# EAGLE design Power Distribution 12 v (EAGLE 7.2.0)
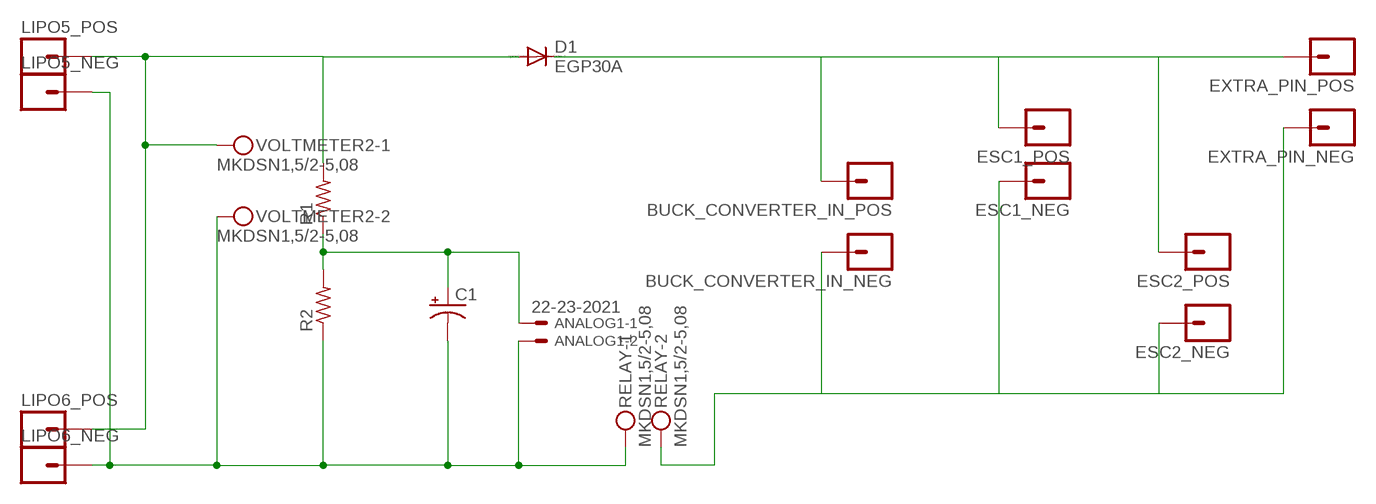
[diagram p0: schematic, sheet 1]

## Parts
ANALOG1  22-23-2021  [22-23-2021]
BUCK_CONVERTER_IN_NEG  M01PTH_2MM  [1X01_2MM]
BUCK_CONVERTER_IN_POS  M01PTH_2MM  [1X01_2MM]
C1  CPOL-USE2-5  [E2-5]
D1  EGP30A  [DO201-15]
ESC1_NEG  M01PTH_2MM  [1X01_2MM]
ESC1_POS  M01PTH_2MM  [1X01_2MM]
ESC2_NEG  M01PTH_2MM  [1X01_2MM]
ESC2_POS  M01PTH_2MM  [1X01_2MM]
EXTRA_PIN_NEG  M01PTH_2MM  [1X01_2MM]
EXTRA_PIN_POS  M01PTH_2MM  [1X01_2MM]
LIPO5_NEG  M01PTH_2MM  [1X01_2MM]
LIPO5_POS  M01PTH_2MM  [1X01_2MM]
LIPO6_NEG  M01PTH_2MM  [1X01_2MM]
LIPO6_POS  M01PTH_2MM  [1X01_2MM]
R1  R-US_0207/10  [0207/10]
R2  R-US_0207/10  [0207/10]
RELAY  MKDSN1,5/2-5,08  [MKDSN1,5/2-5,08]
VOLTMETER2  MKDSN1,5/2-5,08  [MKDSN1,5/2-5,08]

## Nets
N$1: D1.A LIPO5_POS.1 LIPO6_POS.1 R1.2 VOLTMETER2.1
N$2: ANALOG1.1 C1.+ R1.1 R2.2
N$3: ANALOG1.2 C1.- LIPO5_NEG.1 LIPO6_NEG.1 R2.1 RELAY.1 VOLTMETER2.2
N$4: BUCK_CONVERTER_IN_POS.1 D1.C ESC1_POS.1 ESC2_POS.1 EXTRA_PIN_POS.1
N$8: BUCK_CONVERTER_IN_NEG.1 ESC1_NEG.1 ESC2_NEG.1 EXTRA_PIN_NEG.1 RELAY.2

## Library data of the parts
ANALOG1 = con-molex:22-23-2021: .100" (2.54mm) Center Header - 2 Pin; MF: MOLEX; MPN: 22-23-2021; OC_FARNELL: 1462926; OC_NEWARK: 25C3832
BUCK_CONVERTER_IN_NEG BUCK_CONVERTER_IN_POS ESC1_NEG ESC1_POS ESC2_NEG ESC2_POS EXTRA_PIN_NEG EXTRA_PIN_POS LIPO5_NEG LIPO5_POS LIPO6_NEG LIPO6_POS = SparkFun-Connectors:M01: Header 1 Standard 1-pin 0.1" header. Use with straight break away headers (SKU : PRT-00116), right angle break away headers (PRT-00553), swiss pins (PRT-00743), machine pins (PRT-00117), and female headers (PRT-00115).
C1 = adafruit:CPOL-US: POLARIZED CAPACITOR, American symbol
D1 = diode:EGP30A: DIODE ultra fast-recovery rectifier
R1 R2 = adafruit:R-US_: RESISTOR, American symbol
RELAY VOLTMETER2 = con-phoenix-508:MKDSN1,5/2-5,08: MKDSN 1,5/ 2-5,08 Printklemme Nennstrom: 13,5 A Nennspannung: 250 V Rastermaß: 5,08 mm Polzahl: 2 Anschlussart: Schraubanschluss Montage: Löten Anschlussrichtung Leiter/Platine: 0 ° Artikelnummer: 1729128 Source: http://eshop.phoenixcontact.com .. 1729128.pdf

## Board
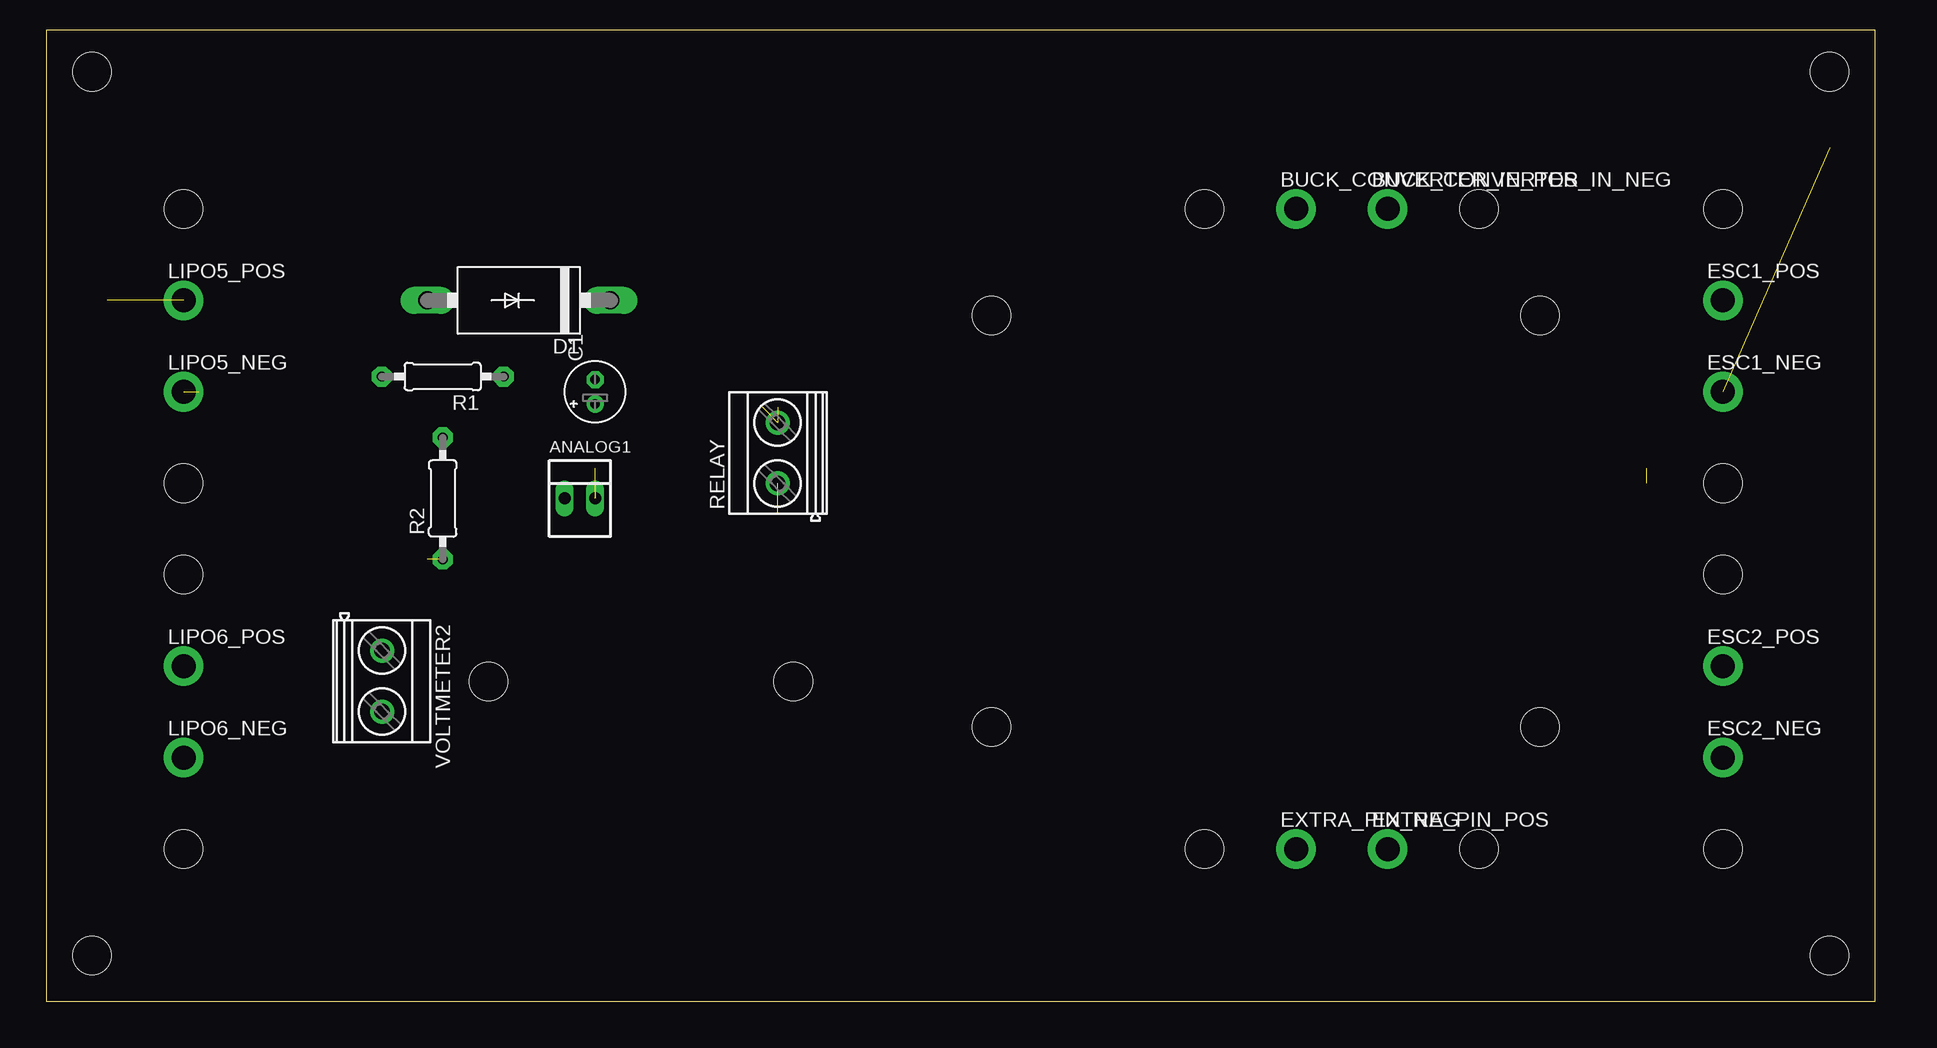
[diagram p1: board, top side]
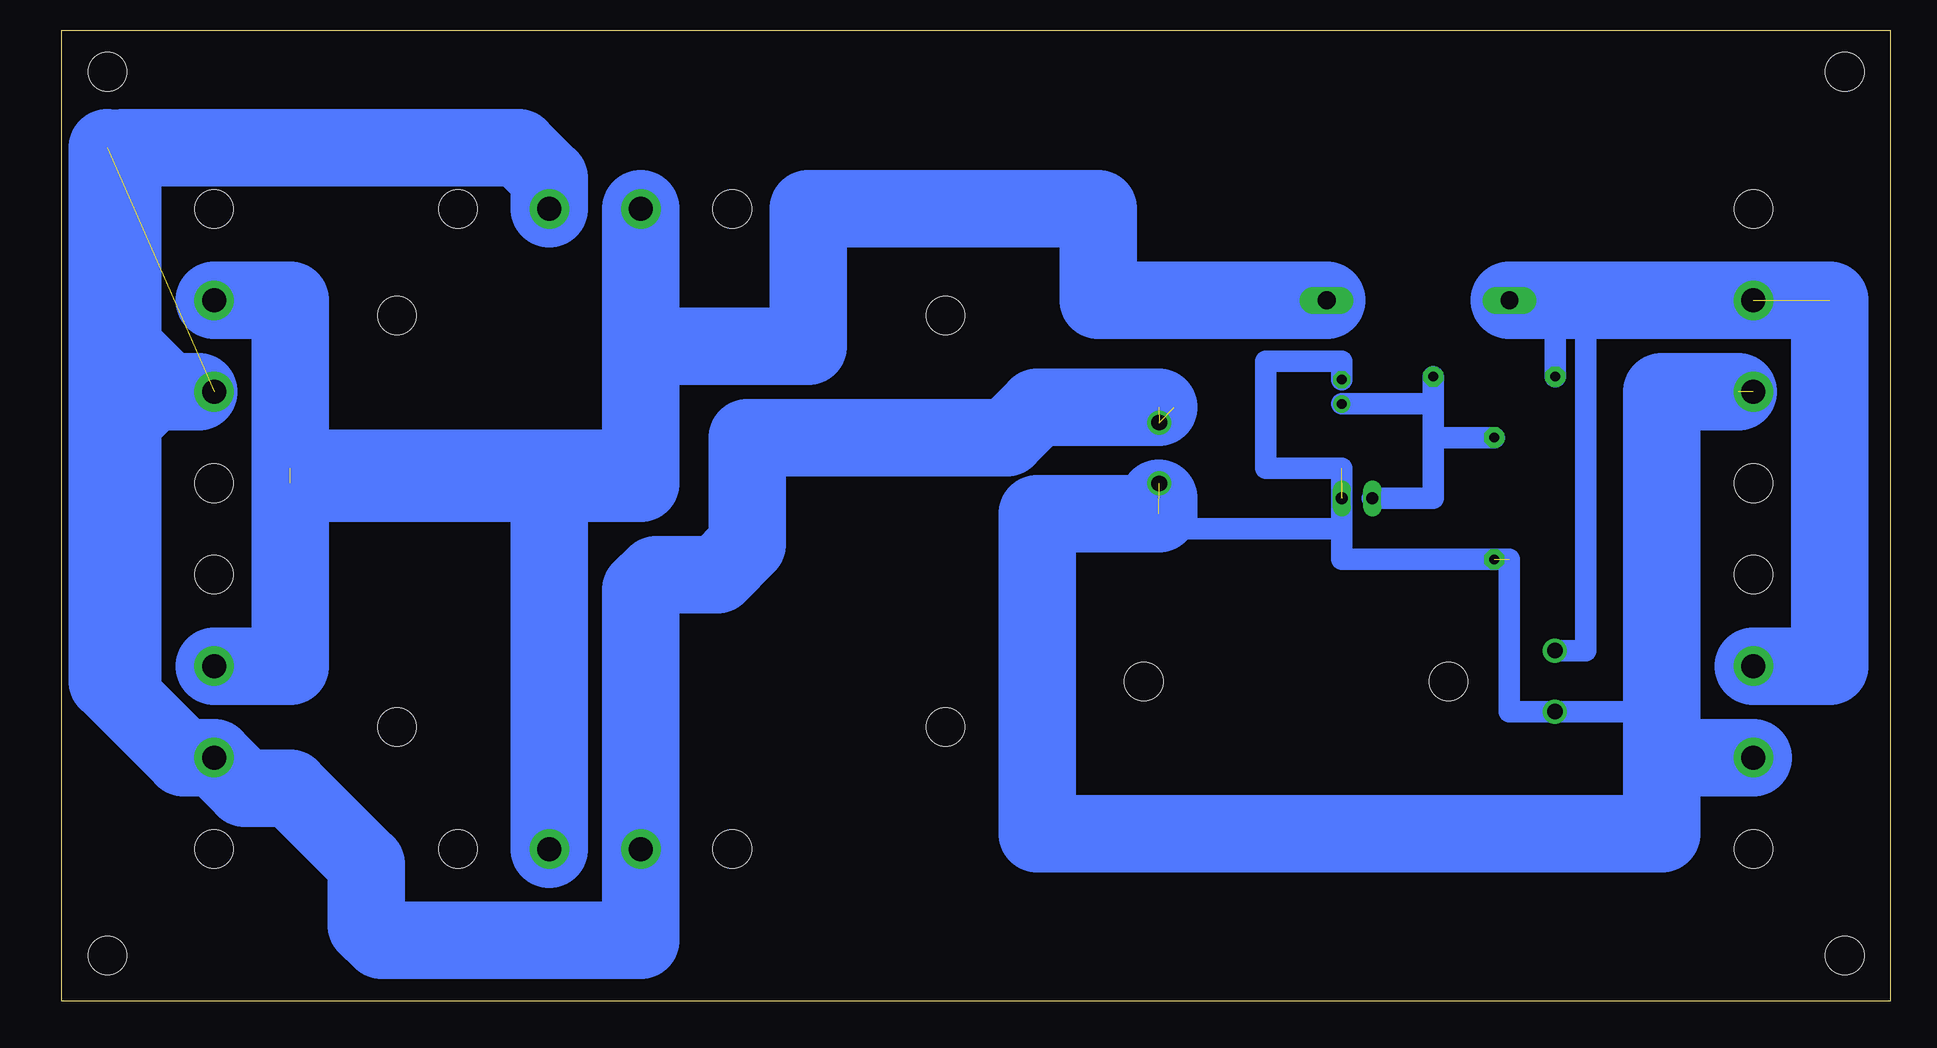
[diagram p2: board, bottom side, seen from below]

Size 152.38 x 80.95 mm. Coordinates in mm from the lower left corner, seen from the top.
Outline: 0,0 152.38,0 152.38,80.95 0,80.95 0,0
Copper layers (1*16): Top 0.035mm / dielectric 1.5mm / Bottom 0.035mm
Design rules "default": minimum track width 10mil, minimum drill 24mil, track to track 8mil, track to pad 8mil, pad to pad 8mil, via to via 8mil, smd to smd 8mil, copper to edge 40mil, drill to drill 8mil, minimum pad ring 10mil, minimum via ring 8mil, stop-mask expansion 4mil, vias tented up to drill 0mil, thermal gap 10mil
Holes 3.2 mm at 3.81,77.47 11.43,66.04 11.43,43.18 11.43,35.56 11.43,12.7 3.81,3.81 36.83,26.67 62.23,26.67 78.74,22.86 78.74,57.15 96.52,66.04 96.52,12.7 119.38,12.7 124.46,22.86 139.7,35.56 139.7,43.18 124.46,57.15 119.38,66.04 139.7,12.7 148.59,3.81 139.7,66.04 148.59,77.47

### Footprints (pad centres in the part's own frame; a part is rotated, then mirrored left to right if it is on the bottom)
22-23-2021 = drill 1 long: 1 -1.27,0; 2 1.27,0
1X01_2MM = drill 2 pad 3.302: 1 0,0
E2-5 = drill 0.813 pad 1.422: + -1.016,0 | drill 0.813 pad 1.422 octagon: - 1.016,0
DO201-15 = drill 1.499 long: A 7.62,0; C -7.62,0
0207/10 = drill 0.813 pad 1.676 octagon: 1 -5.08,0; 2 5.08,0
MKDSN1,5/2-5,08 = drill 1.3 pad 2: 1 -2.561,0.025; 2 2.519,0.025

### Placement (x,y rotation side)
ANALOG1  44.45,41.91 0 top
BUCK_CONVERTER_IN_NEG  111.76,66.04 0 top
BUCK_CONVERTER_IN_POS  104.14,66.04 0 top
C1  45.72,50.8 90 top
D1  39.37,58.42 180 top
ESC1_NEG  139.7,50.8 0 top
ESC1_POS  139.7,58.42 0 top
ESC2_NEG  139.7,20.32 0 top
ESC2_POS  139.7,27.94 0 top
EXTRA_PIN_NEG  104.14,12.7 0 top
EXTRA_PIN_POS  111.76,12.7 0 top
LIPO5_NEG  11.43,50.8 0 top
LIPO5_POS  11.43,58.42 0 top
LIPO6_NEG  11.43,20.32 0 top
LIPO6_POS  11.43,27.94 0 top
R1  33.02,52.07 180 top
R2  33.02,41.91 90 top
RELAY  60.96,45.72 90 top
VOLTMETER2  27.94,26.67 270 top

### Tracks (layer width: path | path; a pad name or v marks a point on that pad's centre or on a via)
N$1  (1 unrouted)
  Bottom 1.778: VOLTMETER2.1 25.42,29.23 25.4,29.21 25.4,59.69 30.48,59.69 D1.A 30.48,58.42 27.94,55.88 R1.2
  Bottom 6.452: D1.A 5.08,58.42 5.08,27.94 LIPO6_POS.1
N$2
  Bottom 1.778: R1.1 38.1,49.53 | 38.1,49.53 38.1,46.99 | 38.1,46.99 R2.2 | C1.+ 38.35,49.78 38.1,49.53 | ANALOG1.1 38.1,41.91 38.1,46.99
N$3  (6 unrouted)
  Bottom 1.778: 19.05,22.86 20.34,24.15 VOLTMETER2.2 31.73,24.15 31.75,24.13 31.75,36.83 45.72,36.83 45.72,39.37 | C1.- 45.72,53.34 52.07,53.34 52.07,44.45 45.72,44.45 45.72,39.37 | 60.96,41.91 58.42,39.37 45.72,39.37
  Bottom 6.452: LIPO6_NEG.1 19.05,20.32 | 19.05,20.32 19.05,22.86 19.05,50.8 12.7,50.8 | 19.05,20.32 19.05,13.97 71.12,13.97 71.12,40.64 60.96,40.64 60.96,41.91
N$4  (1 unrouted)
  Bottom 6.452: D1.C 66.04,58.42 66.04,66.04 90.17,66.04 90.17,54.61 104.14,54.61 BUCK_CONVERTER_IN_POS.1 104.14,43.18 133.35,43.18 133.35,58.42 ESC1_POS.1 | EXTRA_PIN_POS.1 111.76,44.45 | 111.76,44.45 106.68,44.45 | 111.76,44.45 133.35,44.45 133.35,27.94 ESC2_POS.1
N$8  (3 unrouted)
  Bottom 6.452: 148.59,46.99 148.59,26.67 142.24,20.32 ESC2_NEG.1 137.16,17.78 133.35,17.78 127,11.43 127,6.35 125.73,5.08 104.14,5.08 EXTRA_PIN_NEG.1 104.14,34.29 102.87,35.56 97.79,35.56 95.25,38.1 95.25,46.99 73.66,46.99 71.12,49.53 60.96,49.53 | 148.59,46.99 148.59,49.53 | 148.59,49.53 147.32,50.8 | 146.05,50.8 147.32,50.8 | 147.32,50.8 147.32,49.53 | 147.32,26.67 147.32,49.53 | 147.32,49.53 146.05,50.8 | 146.05,50.8 144.78,50.8 | 140.97,50.8 143.51,50.8 | 143.51,50.8 147.32,54.61 147.32,71.12 114.3,71.12 111.76,68.58 BUCK_CONVERTER_IN_NEG.1 | 143.51,50.8 144.78,50.8 | 144.78,50.8 148.59,46.99 | 148.59,49.53 148.59,71.12

### Text on the board
202bmp: C:/Users/Aldwin/Documents/PCB/Power Distribution 12v.bmp